# Altium schematic sheet GARY_Backplane_Oscillators.SchDoc: Backplane: Oscillator Section
size Letter; Engineer: Nicholas Morrow; Project: GARY Synthesizer
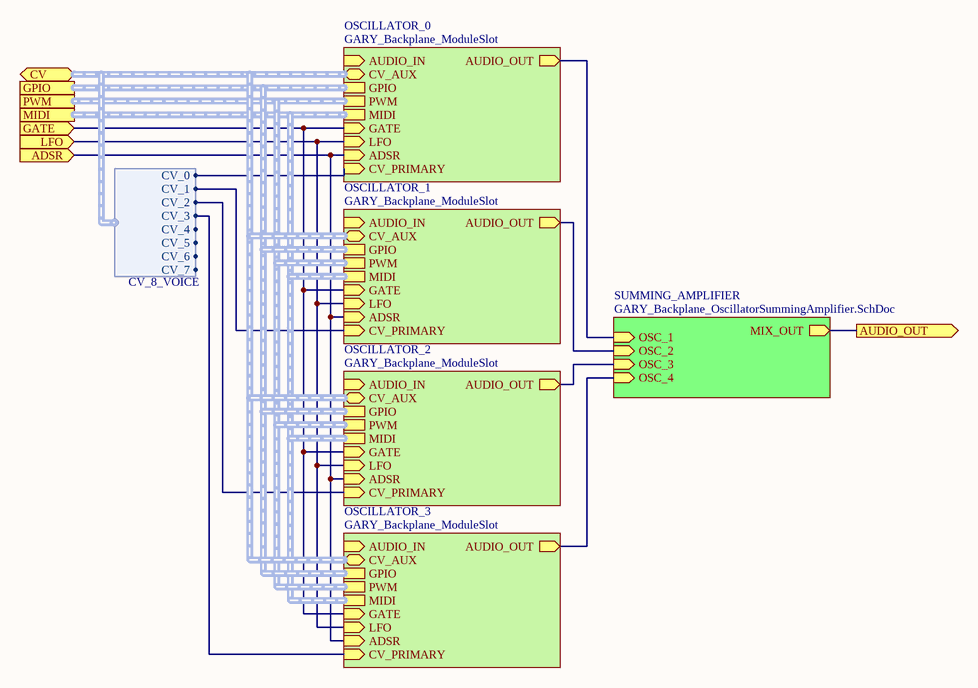
[diagram p0: GARY_Backplane_Oscillators.SchDoc]

## Sub-sheets
OSCILLATOR_0 = GARY_Backplane_ModuleSlot: GPIO (harness GPIO), MIDI (harness MIDI), PWM (harness PWM), LFO (in), ADSR (in), GATE (in), AUDIO_IN (in), AUDIO_OUT (out), CV_AUX (harness CV_8_VOICE), CV_PRIMARY (in)
OSCILLATOR_1 = GARY_Backplane_ModuleSlot: GPIO (harness GPIO), MIDI (harness MIDI), PWM (harness PWM), LFO (in), ADSR (in), GATE (in), AUDIO_IN (in), AUDIO_OUT (out), CV_AUX (harness CV_8_VOICE), CV_PRIMARY (in)
OSCILLATOR_2 = GARY_Backplane_ModuleSlot: GPIO (harness GPIO), MIDI (harness MIDI), PWM (harness PWM), LFO (in), ADSR (in), GATE (in), AUDIO_IN (in), AUDIO_OUT (out), CV_AUX (harness CV_8_VOICE), CV_PRIMARY (in)
OSCILLATOR_3 = GARY_Backplane_ModuleSlot: GPIO (harness GPIO), MIDI (harness MIDI), PWM (harness PWM), LFO (in), ADSR (in), GATE (in), AUDIO_IN (in), AUDIO_OUT (out), CV_AUX (harness CV_8_VOICE), CV_PRIMARY (in)
SUMMING_AMPLIFIER = GARY_Backplane_OscillatorSummingAmplifier.SchDoc: OSC_1 (in), OSC_2 (in), OSC_3 (in), OSC_4 (in), MIX_OUT (out)

## Ports
ADSR (in), AUDIO_OUT (out), CV (harness CV_8_VOICE), GATE (in), GPIO (harness GPIO), LFO (in), MIDI (harness MIDI), PWM (harness PWM)

## Harnesses
CV_8_VOICE: CV_0, CV_2, CV_4, CV_6, CV_1, CV_3, CV_5, CV_7

## Nets
ADSR: port ADSR, sheet OSCILLATOR_0/ADSR, sheet OSCILLATOR_1/ADSR, sheet OSCILLATOR_2/ADSR, sheet OSCILLATOR_3/ADSR
AUDIO_OUT: port AUDIO_OUT, sheet SUMMING_AMPLIFIER/MIX_OUT
GATE: port GATE, sheet OSCILLATOR_0/GATE, sheet OSCILLATOR_1/GATE, sheet OSCILLATOR_2/GATE, sheet OSCILLATOR_3/GATE
LFO: port LFO, sheet OSCILLATOR_0/LFO, sheet OSCILLATOR_1/LFO, sheet OSCILLATOR_2/LFO, sheet OSCILLATOR_3/LFO
(unnamed): sheet SUMMING_AMPLIFIER/OSC_1, sheet OSCILLATOR_0/AUDIO_OUT
(unnamed): sheet SUMMING_AMPLIFIER/OSC_2, sheet OSCILLATOR_1/AUDIO_OUT
(unnamed): sheet SUMMING_AMPLIFIER/OSC_3, sheet OSCILLATOR_2/AUDIO_OUT
(unnamed): sheet SUMMING_AMPLIFIER/OSC_4, sheet OSCILLATOR_3/AUDIO_OUT
(unnamed): sheet OSCILLATOR_0/CV_PRIMARY, port CV.CV_0
(unnamed): sheet OSCILLATOR_1/CV_PRIMARY, port CV.CV_1
(unnamed): sheet OSCILLATOR_2/CV_PRIMARY, port CV.CV_2
(unnamed): sheet OSCILLATOR_3/CV_PRIMARY, port CV.CV_3

## Buses and harness runs
harness port CV = sheet OSCILLATOR_0/CV_AUX = sheet OSCILLATOR_1/CV_AUX = sheet OSCILLATOR_2/CV_AUX = sheet OSCILLATOR_3/CV_AUX
harness port GPIO = sheet OSCILLATOR_0/GPIO = sheet OSCILLATOR_1/GPIO = sheet OSCILLATOR_2/GPIO = sheet OSCILLATOR_3/GPIO
harness port MIDI = sheet OSCILLATOR_0/MIDI = sheet OSCILLATOR_1/MIDI = sheet OSCILLATOR_2/MIDI = sheet OSCILLATOR_3/MIDI
harness port PWM = sheet OSCILLATOR_0/PWM = sheet OSCILLATOR_1/PWM = sheet OSCILLATOR_2/PWM = sheet OSCILLATOR_3/PWM

## Notes on the sheet
- Notes:
- Title:
- Size:
- Project:
- Letter
- Number:
- Revision:
- Date:
- Engineer:
- Sheet:
- of